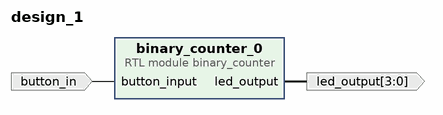
[diagram p0: block diagram of the top level]
# Vivado block design design_1, xc7a35ticsg324-1L, Vivado 2022.2
create_bd_design design_1

create_bd_port -dir I -type data button_in
create_bd_port -dir O -from 3 -to 0 -type data led_output

create_bd_cell -type module -reference binary_counter binary_counter_0

# ---- connections ----

connect_bd_net [get_bd_pins binary_counter_0/led_output] [get_bd_ports led_output]
connect_bd_net [get_bd_ports button_in] [get_bd_pins binary_counter_0/button_input]

validate_bd_design
save_bd_design
